# Altium project USB_TTL.PrjPcb
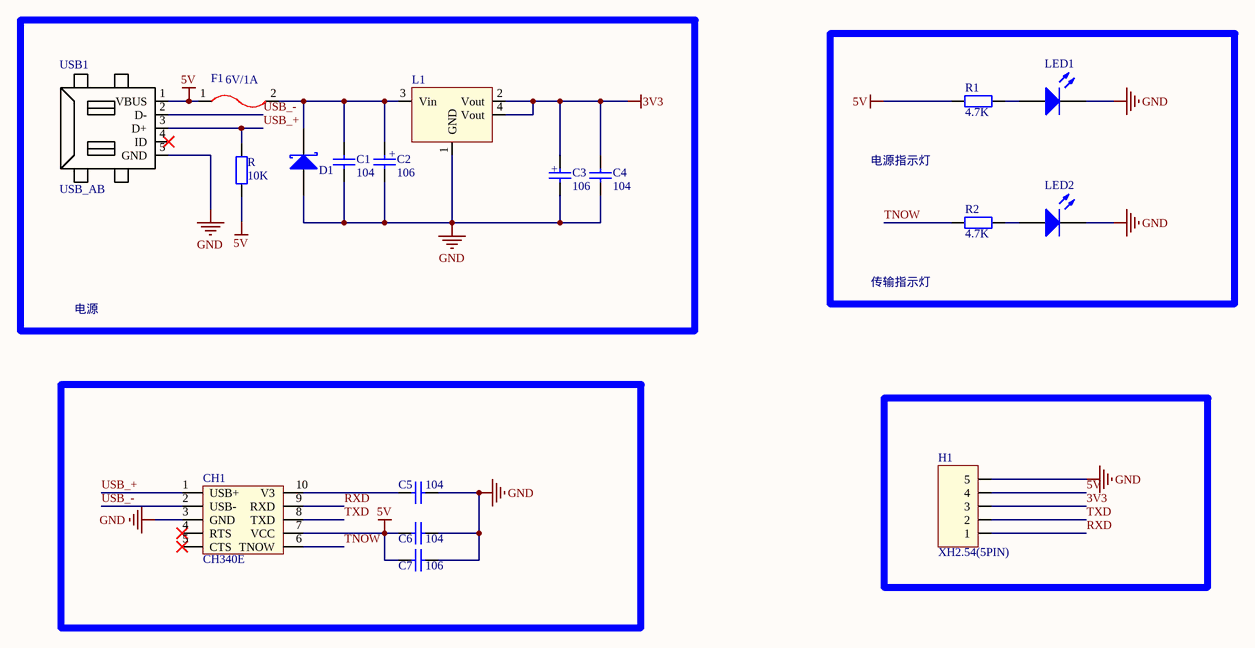
[diagram p0: Sheet1.SchDoc]
1 sheet, 18 parts. Net scope: global (net labels, ports and power ports of the same name join across sheets).
Board file: PCB1.PcbDoc

## Sheet Sheet1.SchDoc
size A4

### Parts
C1  104  [C_SOP_0603]
C2  106  [C_SOP_1206]
C3  106  [C_SOP_1206]
C4  104  [C_SOP_0603]
C5  104  [C_SOP_0603]
C6  104  [C_SOP_0603]
C7  106  [C_SOP_0603]
CH1  CH340E  [MSOP_10]
D1  DIODE  [LC-SMA(DO-214AC)_S5]  (value not drawn)
F1  6V/1A  [Fuse_0805]
H1  XH2.54(5PIN)  [Header 2.54X5]
L1  LDO-3.3-AMS1117  [SOT223_3]  (value not drawn)
LED1  LED  [LED_0603_R]  (value not drawn)
LED2  LED  [LED_0603_R]  (value not drawn)
R  10K  [R_SMD_0603]
R1  4.7K  [R_SMD_0603]
R2  4.7K  [R_SMD_0603]
USB1  USB_AB  [USB_MINI_SMD]

### Nets
3V3: C3.1 C4.1 H1.3 L1.2(Vout) L1.4(Vout)
5V: C6.1 C7.1 CH1.7(VCC) F1.1(OUT) H1.4 R.1 R1.1 USB1.1(VBUS)
GND: C1.1 C2.1 C3.2 C4.2 C5.2 C6.2 C7.2 CH1.3(GND) D1.2(A) H1.5 L1.1(GND) LED1.2(K) LED2.2(K) USB1.5(GND)
RXD: CH1.9(RXD) H1.1
TNOW: CH1.6(TNOW) R2.1
TXD: CH1.8(TXD) H1.2
USB_+: CH1.1(USB+) R.2 USB1.3(D+)
USB_-: CH1.2(USB-) USB1.2(D-)
NetC1_2: C1.2 C2.2 D1.1(K) F1.2(OUT) L1.3(Vin)
NetC5_1: C5.1 CH1.10(V3)
NetLED1_1: LED1.1(A) R1.2
NetLED2_1: LED2.1(A) R2.2

Not connected (* = marked no-connect by the designer): CH1 4(RTS)* 5(CTS)*; USB1 4(ID)*

### Notes on the sheet
- (near C2) +
- (near C3) +
- 电源指示灯
- 电源
- 传输指示灯

### Library data of the parts
C1-C7 = C_SMD
F1 = FUSE
R R1 R2 = R_SMD